# EAGLE design v2 (EAGLE 9.0.0)
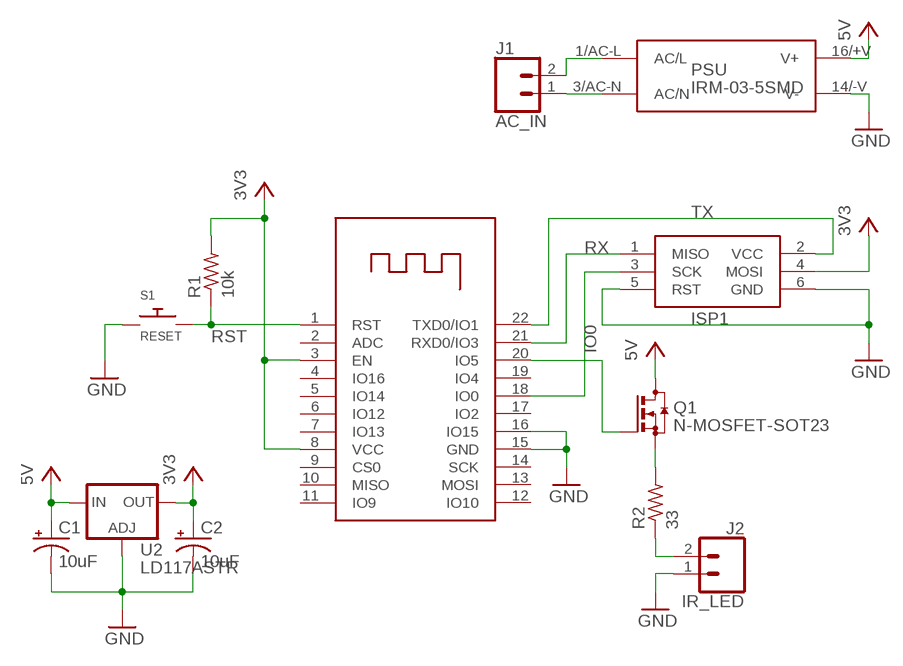
[diagram p0: schematic, sheet 1]

## Parts
C1  10uF  CPOL-US153CLV-0405  [153CLV-0405]
C2  10uF  CPOL-US153CLV-0405  [153CLV-0405]
ISP1  AVRISP-6  [AVRISP]
J1  AC_IN  1X2_5MM_SCREW  [1X2_5MM_SCREW]
J2  IR_LED  1X2_5MM_SCREW  [1X2_5MM_SCREW]
PSU  IRM-03-5SMD  [IRM-03-5S]
Q1  N-MOSFET-SOT23  [SOT23]
R1  10k  R-US_R0805  [R0805]
R2  33  R-US_MELF0207R  [MINI_MELF-0207R]
S1  RESET  BUTTON  [B3F-1000]
U1  ESP-12F  [ESP-12F]
U2  LD117ASTR  [SOT223]

## Nets
3V3: C2.+ ISP1.4(MOSI) R1.2 U1.3(EN) U1.8(VCC) U2.4(OUT)
5V: C1.+ PSU.16/+V(V+) Q1.3(D) U2.3(IN)
AC/L: J1.2 PSU.1/AC-L(AC/L)
AC/N: J1.1 PSU.3/AC-N(AC/N)
GND: C1.- C2.- ISP1.5(RST) ISP1.6(GND) J2.1 PSU.14/-V(V-) S1.1 S1.2 U1.15(GND) U1.16(IO15) U2.1(ADJ)
IO0: ISP1.3(SCK) U1.18(IO0)
LED: Q1.1(G) U1.20(IO5)
N$5: Q1.2(S) R2.2
N$6: J2.2 R2.1
RST: R1.1 S1.3 S1.4 U1.1(RST)
RX: ISP1.1(MISO) U1.21(RXD0/IO3)
TX: ISP1.2(VCC) U1.22(TXD0/IO1)
Unconnected: U1.2(ADC) U1.4(IO16) U1.5(IO14) U1.6(IO12) U1.7(IO13) U1.9(CS0) U1.10(MISO) U1.11(IO9) U1.12(IO10) U1.13(MOSI) U1.14(SCK) U1.17(IO2) U1.19(IO4)

## Library data of the parts
C1 C2 = resistor:CPOL-US: POLARIZED CAPACITOR, American symbol
ISP1 = my_parts:AVRISP: AVR ISP HEADER Standard 6 pin header for AVR programming
J1 J2 = my_parts:1X2_5MM_SCREW
PSU = my_parts:IRM-03-5
Q1 = my_parts:N-MOSFET
R1 R2 = resistor:R-US_: RESISTOR, American symbol
S1 = my_parts:BUTTON
U1 = my_parts:ESP-12F
U2 = v-reg:LD117A?*: Low drop fixed and adjustable positive voltage regulators 1 A Source: http://www.st.com/stonline/products/literature/ds/7194/ld1117axx.pdf

## Board
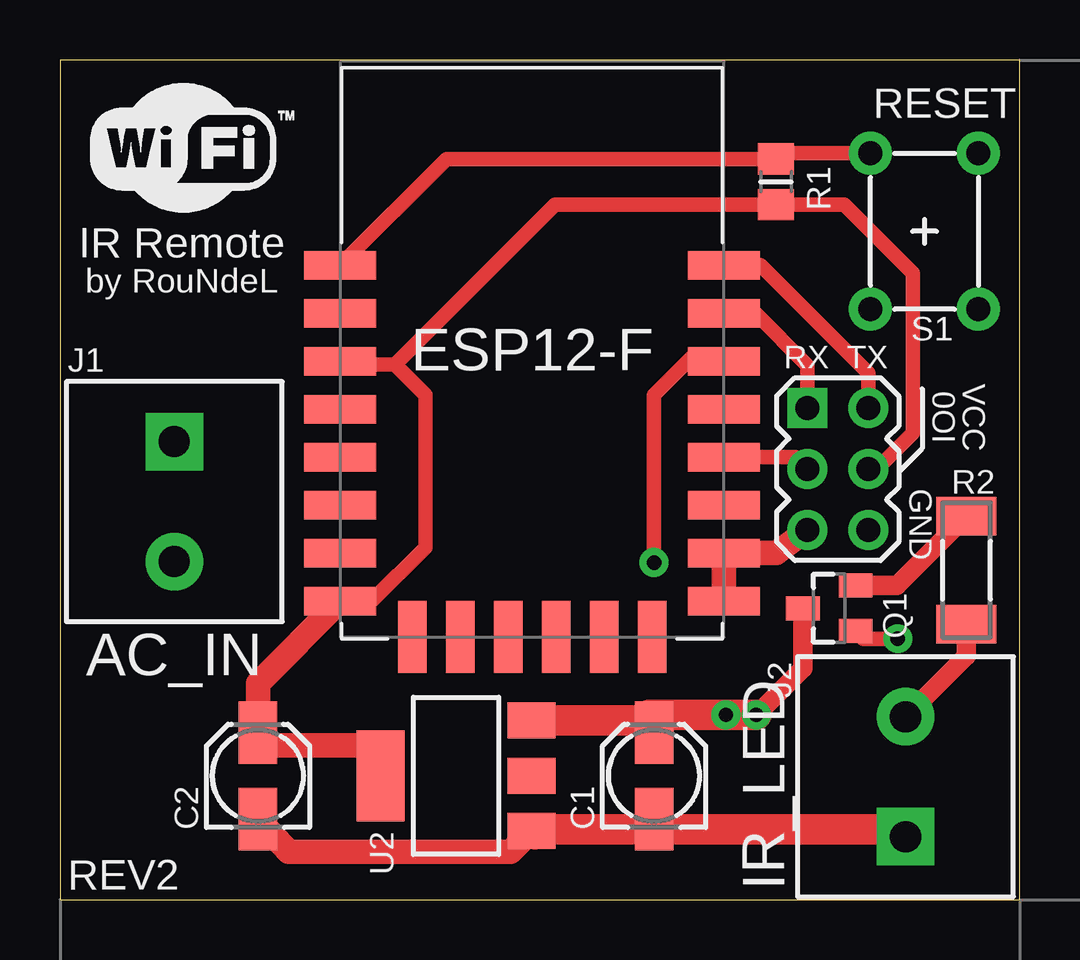
[diagram p1: board, top side]
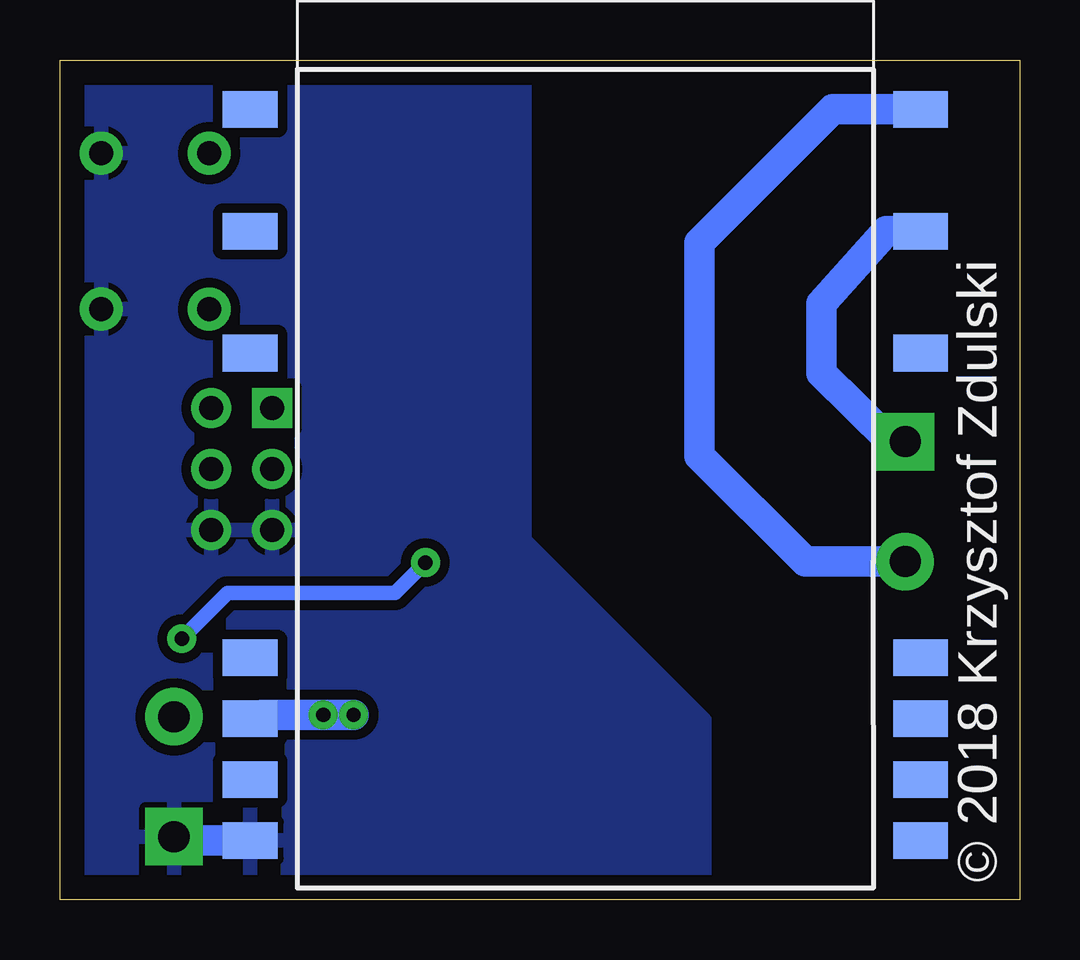
[diagram p2: board, bottom side, seen from below]

Size 40 x 35 mm. Coordinates in mm from the lower left corner, seen from the top.
Outline: 0,0 40,0 40,35 0,35 0,0
Copper layers (1*16): Top 0.035mm / dielectric 1.5mm / Bottom 0.035mm
Design rules "default *": minimum track width 6mil, minimum drill 0.35mm, track to track 6mil, track to pad 6mil, pad to pad 6mil, via to via 6mil, smd to smd 6mil, copper to edge 40mil, drill to drill 6mil, minimum pad ring 10mil, minimum via ring 8mil, stop-mask expansion 4mil, vias tented up to drill 0.6mm, thermal gap 10mil

### Footprints (pad centres in the part's own frame; a part is rotated, then mirrored left to right if it is on the bottom)
153CLV-0405 = smd 2.6 x 1.6: + 1.8,0; - -1.8,0
AVRISP = drill 1 pad 1.676 square: 1 -1.27,2.54 | drill 1 pad 1.676: 2 1.27,2.54; 3 -1.27,0; 4 1.27,0; 5 -1.27,-2.54; 6 1.27,-2.54
1X2_5MM_SCREW = drill 1.3 pad 2.4 square: 1 2.5,0 | drill 1.3 pad 2.4: 2 -2.5,0
IRM-03-5S = smd 1.524 x 2.286: 1/AC-L -13.97,13.97; 3/AC-N -8.89,13.97; 5 -3.81,13.97; 10 8.89,13.97; 11 11.43,13.97; 12 13.97,13.97; 13 16.51,13.97; 14/-V 16.51,-13.97; 15 13.97,-13.97; 16/+V 11.43,-13.97; 17 8.89,-13.97; 22 -3.81,-13.97; 24 -8.89,-13.97; 26 -13.97,-13.97
SOT23 = smd 1 x 1.4: 1 -0.95,-1.1; 2 0.95,-1.1; 3 0,1.1
R0805 = smd 1.3 x 1.5: 1 -0.95,0; 2 0.95,0
MINI_MELF-0207R = smd 1.6 x 2.5: 1 -2.25,0; 2 2.25,0
B3F-1000 = drill 1 pad 1.778: 1 -3.25,2.25; 2 3.25,2.25; 3 -3.25,-2.25; 4 3.25,-2.25
ESP-12F = smd 3 x 1.2: 1 -8,3.5; 2 -8,1.5; 3 -8,-0.5; 4 -8,-2.5; 5 -8,-4.5; 6 -8,-6.5; 7 -8,-8.5; 8 -8,-10.5; 15 8,-10.5; 16 8,-8.5; 17 8,-6.5; 18 8,-4.5; 19 8,-2.5; 20 8,-0.5; 21 8,1.5; 22 8,3.5 | smd 1.2 x 3: 9 -5,-12; 10 -3,-12; 11 -1,-12; 12 1,-12; 13 3,-12; 14 5,-12
SOT223 = smd 1.5 x 2: 1 -2.3,-3.15; 2 0,-3.15; 3 2.3,-3.15 | smd 3.8 x 2: 4 0,3.15

### Placement (x,y rotation side)
C1  24.77,5.16 90 top
C2  8.26,5.16 90 top
ISP1  32.42,17.95 0 top
J1  4.76,16.59 90 top
J2  35.25,5.12 270 top
PSU  18.1,18.97 270 bottom
Q1  32.07,12.14 90 top
R1  29.84,29.92 270 top
R2  37.78,13.73 90 top
S1  36.03,27.86 270 top
U1  19.68,22.94 0 top
U2  16.51,5.16 90 top

### Tracks (layer width: path | path; a pad name or v marks a point on that pad's centre or on a via)
3V3
  Top 0.61: 13.97,22.3 20.64,28.98 R1.2 32.7,28.98 35.56,26.11 35.56,19.45 34.06,17.95 ISP1.4 | 13.97,22.3 11.19,22.3 U1.3 | U1.8 12.99,12.44 15.24,14.68 15.24,21.04 13.97,22.3
  Top 1.016: U1.8 8.26,9.01 C2.+ 8.79,6.43 13.34,6.43 13.36,6.4 U2.4
5V  (via drill 0.6 pad 1.2)
  Top 0.813: v29.03,7.7 30.97,9.64 Q1.3
  Top 1.27: v29.03,7.7 v27.76,7.7 24.55,7.7 C1.+ 24.27,7.46 U2.3
  Bottom 0.813: 31.59,7.7 PSU.16/+V
  Bottom 1.27: v27.76,7.7 31.59,7.7
AC/L
  Bottom 1.27: PSU.1/AC-L 7.78,32.94 13.34,27.38 13.34,18.5 8.93,14.09 J1.2
AC/N
  Bottom 1.27: J1.1 5.36,19.09 5.4,19.13 8.26,21.95 8.26,24.84 5.55,27.86 PSU.3/AC-N
GND
  Top 1.016: U2.1 18.79,1.99 9.53,1.99 C2.- | 24.98,2.93 C1.- | U1.15 U1.16 29.87,14.44 ISP1.5
  Top 1.27: 19.8,2.72 U2.1 19.73,2.93 24.98,2.93 | C1.- 25.19,2.94 35.56,2.94 35.56,2.93 J2.1
  Bottom 1.27: PSU.14/-V 35.09,2.46 J2.1
  pour Bottom (isolate 0.406): 40,0 13.13,0 13.13,7.5 20.64,15 20.64,35 40,35
IO0
  Top 0.61: ISP1.3 30.66,18.44 U1.18
LED  (via drill 0.6 pad 1.2)
  Top 0.61: Q1.1 33.49,10.88 v34.92,10.88 | v24.77,14.05 24.77,21.04 26.35,22.62 26.54,22.44 U1.20
  Bottom 0.61: v34.92,10.88 33.02,12.78 26.04,12.78 v24.77,14.05
N$5
  Top 0.813: Q1.2 34.9,13.09 R2.2
N$6
  Top 0.813: R2.1 37.78,10.15 J2.2
RST
  Top 0.61: U1.1 16.12,30.88 R1.1 30.24,31.11 S1.3
RX
  Top 0.61: ISP1.1 31.15,22.27 28.98,24.44 U1.21
TX
  Top 0.61: U1.22 29.2,26.44 33.69,21.95 ISP1.2

### Text on the board
_tplace: IR Remote | by RouNdeL | ESP12-F | RX | TX | IO0 | VCC | GND | REV2
_bplace: © 2018 Krzysztof Zdulski